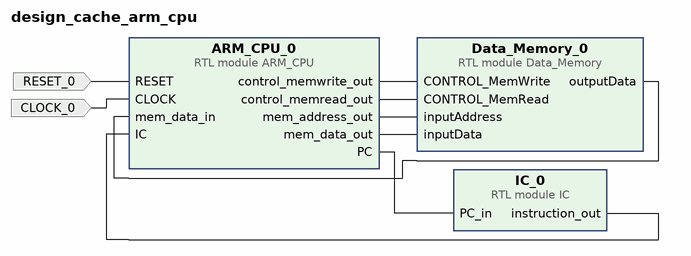
[diagram p0: block diagram of the top level]
# Vivado block design design_cache_arm_cpu, xc7a100tcsg324-1, Vivado 2018.3
create_bd_design design_cache_arm_cpu

create_bd_port -dir I -type rst RESET_0
create_bd_port -dir I -type clk CLOCK_0

create_bd_cell -type module -reference ARM_CPU ARM_CPU_0
create_bd_cell -type module -reference Data_Memory Data_Memory_0
create_bd_cell -type module -reference IC IC_0

# ---- connections ----

connect_bd_net [get_bd_pins ARM_CPU_0/PC] [get_bd_pins IC_0/PC_in]
connect_bd_net [get_bd_pins IC_0/instruction_out] [get_bd_pins ARM_CPU_0/IC]
connect_bd_net [get_bd_pins Data_Memory_0/outputData] [get_bd_pins ARM_CPU_0/mem_data_in]
connect_bd_net [get_bd_pins ARM_CPU_0/control_memwrite_out] [get_bd_pins Data_Memory_0/CONTROL_MemWrite]
connect_bd_net [get_bd_pins ARM_CPU_0/control_memread_out] [get_bd_pins Data_Memory_0/CONTROL_MemRead]
connect_bd_net [get_bd_pins ARM_CPU_0/mem_address_out] [get_bd_pins Data_Memory_0/inputAddress]
connect_bd_net [get_bd_pins ARM_CPU_0/mem_data_out] [get_bd_pins Data_Memory_0/inputData]
connect_bd_net -net RESET_0_1 [get_bd_ports RESET_0] [get_bd_pins ARM_CPU_0/RESET]
connect_bd_net -net CLOCK_0_1 [get_bd_ports CLOCK_0] [get_bd_pins ARM_CPU_0/CLOCK]

validate_bd_design
save_bd_design
